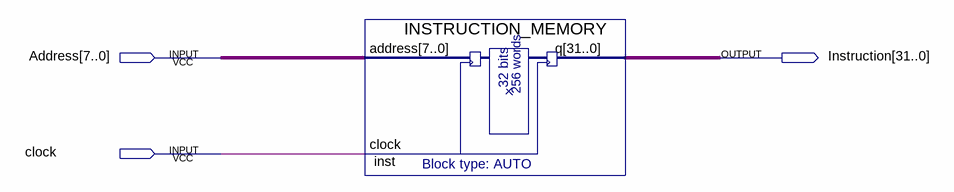
[diagram p0: schematic sheet]
// Quartus schematic Instruction_memory_diagram.bdf as structural Verilog: 1 symbols, 3 pins
module Instruction_memory_diagram (
  input  [7:0] Address,
  input  clock,
  output [31:0] Instruction
);

  INSTRUCTION_MEMORY inst (.address(Address), .clock(clock), .q(Instruction));
endmodule
